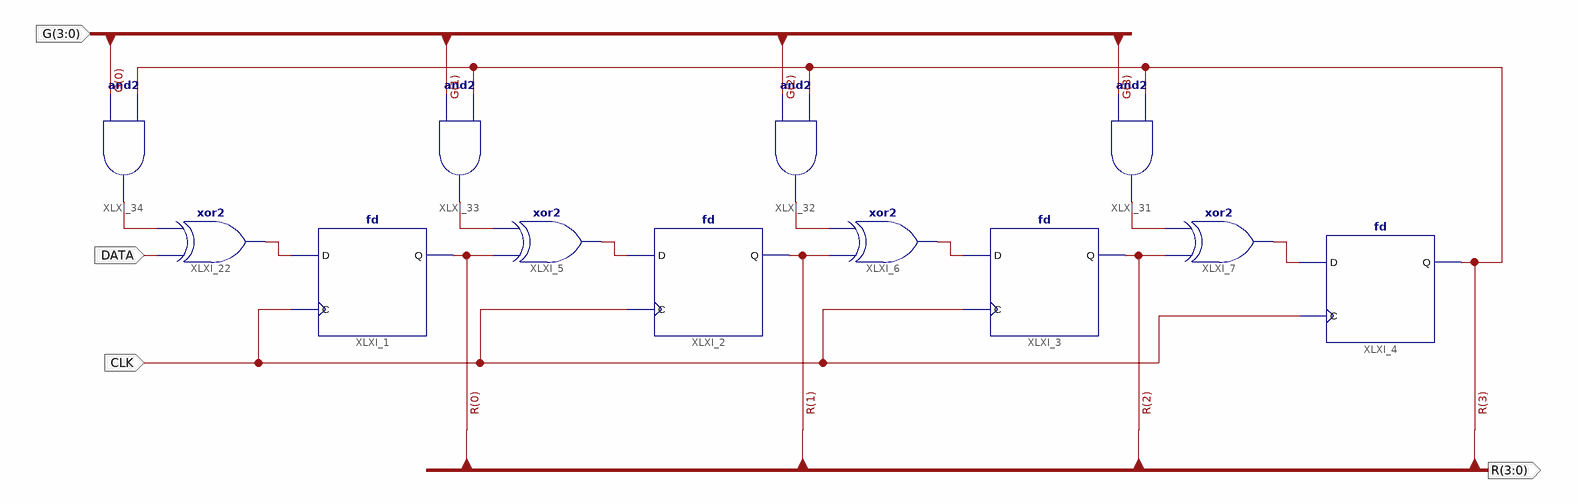
[diagram p0: schematic sheet 1]
// Xilinx ISE schematic CRCgenerator.sch (spartan6) as structural Verilog: 12 symbols, 4 ports
module CRCgenerator (
  input  DATA,
  input  CLK,
  input  [3:0] G,
  output [3:0] R
);

  wire XLXN_1, XLXN_3, XLXN_7, XLXN_9, XLXN_10, XLXN_11, XLXN_12, XLXN_13;

  fd XLXI_1 (.C(CLK), .D(XLXN_1), .Q(R[0]));
  xor XLXI_5 (XLXN_3, R[0], XLXN_10);
  fd XLXI_2 (.C(CLK), .D(XLXN_3), .Q(R[1]));
  xor XLXI_6 (XLXN_7, R[1], XLXN_11);
  fd XLXI_3 (.C(CLK), .D(XLXN_7), .Q(R[2]));
  xor XLXI_7 (XLXN_9, R[2], XLXN_12);
  fd XLXI_4 (.C(CLK), .D(XLXN_9), .Q(R[3]));
  xor XLXI_22 (XLXN_1, DATA, XLXN_13);
  and XLXI_31 (XLXN_12, G[3], R[3]);
  and XLXI_32 (XLXN_11, G[2], R[3]);
  and XLXI_33 (XLXN_10, G[1], R[3]);
  and XLXI_34 (XLXN_13, G[0], R[3]);
endmodule
